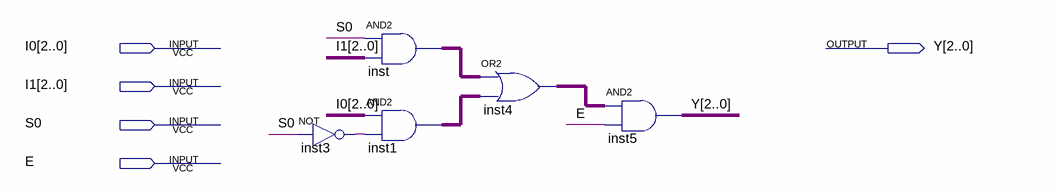
[diagram p0: schematic sheet]
// Quartus schematic MX2_3.bdf as structural Verilog: 5 symbols, 5 pins
module MX2_3 (
  input  [2:0] I0,
  input  [2:0] I1,
  input  S0,
  input  E,
  output [2:0] Y
);

  wire inst3_out;
  wire [2:0] inst1_out, inst4_out, inst_out;

  not inst3 (inst3_out, S0);
  assign inst_out = {3{S0}} & I1;  // AND2 inst, 3 bits wide
  assign inst1_out = I0 & {3{inst3_out}};  // AND2 inst1, 3 bits wide
  assign inst4_out = inst_out | inst1_out;  // OR2 inst4, 3 bits wide
  assign Y = inst4_out & {3{E}};  // AND2 inst5, 3 bits wide
endmodule
